# Altium project Wireless Jukebox.PrjPcb
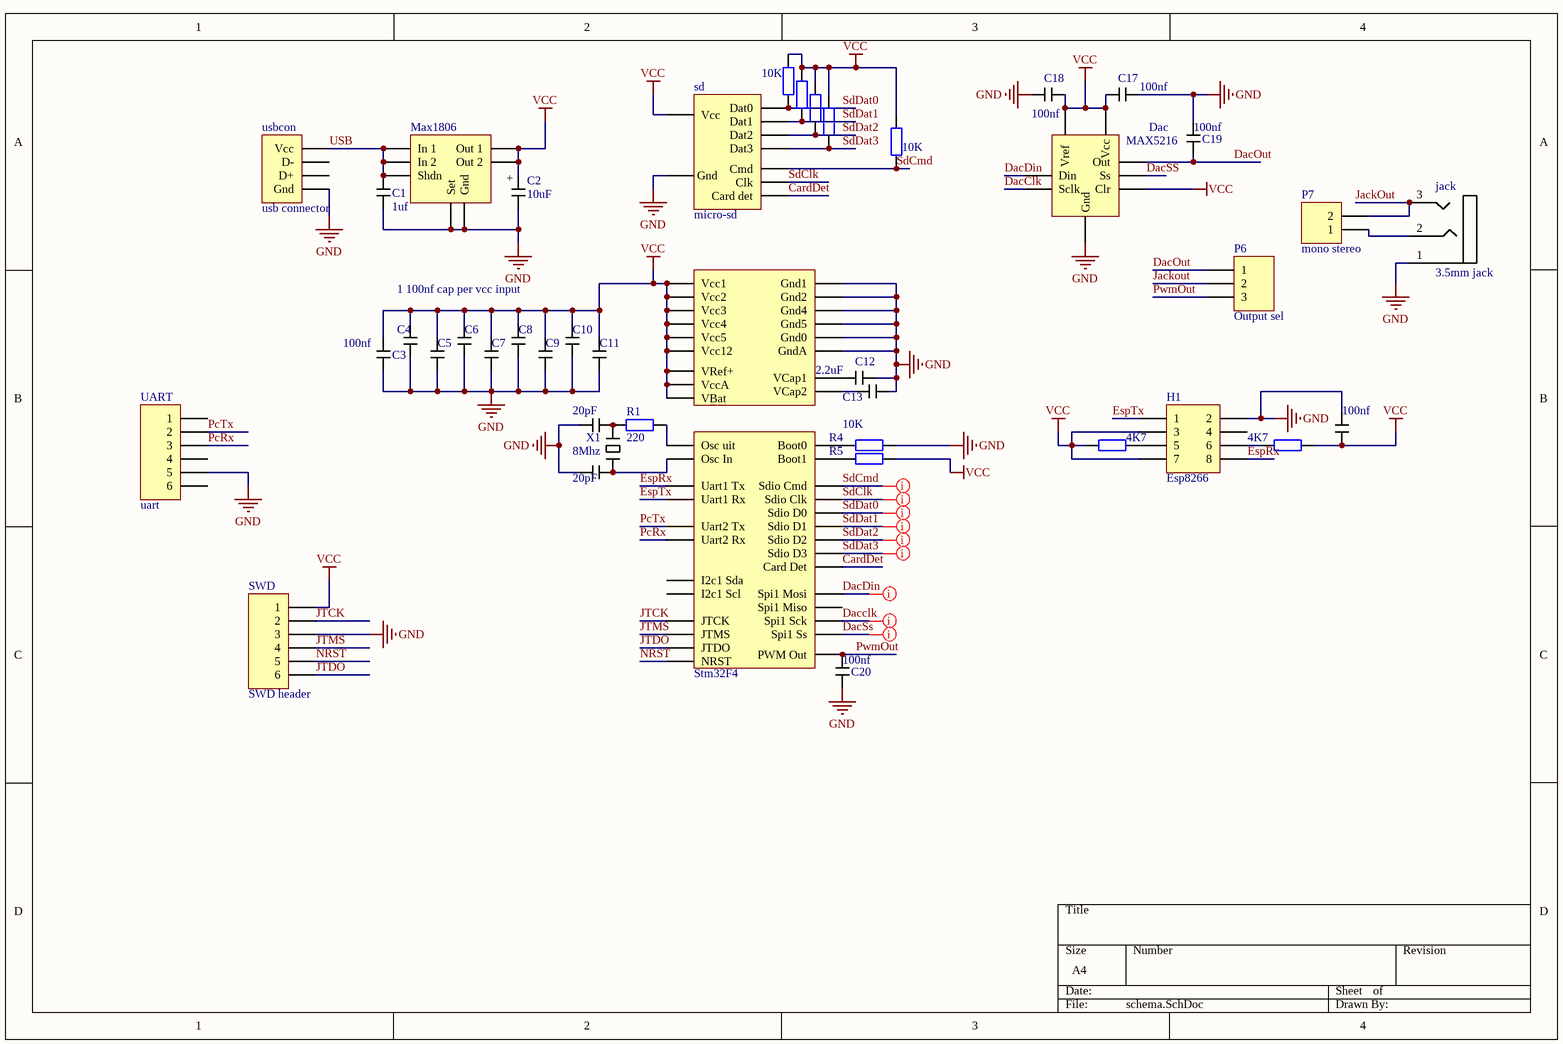
[diagram p0: schema.SchDoc]
1 sheet, 42 parts. Net scope: global (net labels, ports and power ports of the same name join across sheets).
Board file: PCB.PcbDoc

## Sheet schema.SchDoc
size A4

### Parts
C1  value 1uf  [RESC2012N]  (hidden comment: capacitor)
C2  value 10uF  [Capacitor]  (hidden comment: capacitor)
C3  value 100nf  [RESC2012N]  (hidden comment: capacitor)
C4  capacitor  [RESC2012N]  (value not drawn)
C5  capacitor  [RESC2012N]  (value not drawn)
C6  capacitor  [RESC2012N]  (value not drawn)
C7  capacitor  [RESC2012N]  (value not drawn)
C8  capacitor  [RESC2012N]  (value not drawn)
C9  capacitor  [RESC2012N]  (value not drawn)
C10  capacitor  [RESC2012N]  (value not drawn)
C11  capacitor  [RESC2012N]  (value not drawn)
C12  value 2.2uF  [RESC2012N]  (hidden comment: capacitor)
C13  capacitor  [RESC2012N]  (value not drawn)
C14  value 20pF  [RESC2012N]  (hidden comment: capacitor)
C15  value 20pF  [RESC2012N]  (hidden comment: capacitor)
C16  value 100nf  [RESC2012N]  (hidden comment: capacitor)
C17  value 100nf  [RESC2012N]  (hidden comment: capacitor)
C18  value 100nf  [RESC2012N]  (hidden comment: capacitor)
C19  value 100nf  [RESC2012N]  (hidden comment: capacitor)
C20  value 100nf  [RESC2012N]  (hidden comment: capacitor)
Dac  MAX5216  [uMax8]
H1  Esp8266  [HDR2X4]
jack  3.5mm jack  [3.5 jack]
Max1806  Max1806  [uMax8]  (value not drawn)
P6  Output sel  [HDR1X3]
P7  mono stereo  [HDR1X2]
R1  value 220  [RESC2012N]
R2  value 4K7  [RESC2012N]
R3  value 4K7  [RESC2012N]
R4  value 10K  [RESC2012N]
R5  (no value)  [RESC2012N]
R7  (no value)  [RESC2012N]
R8  value 10K  [RESC2012N]
R9  (no value)  [RESC2012N]
R10  value 10K  [RESC2012N]
R-Pullup  (no value)  [RESC2012N]
sd  micro-sd  [Micro-sd-socket]
Stm32F4  stm32f411vet6  [LQFP100]  (value not drawn)
SWD  SWD header  [HDR1X6]
UART  uart  [HDR1X6]
usbcon  usb connector  [usb B-con]
X1  8Mhz  [HC-49S]

### Nets
GND: C1.1(p0) C2.1(p0) C3.1(p0) C4.1(p0) C5.1(p0) C6.1(p0) C7.1(p0) C8.1(p0) C9.2(p1) C10.1(p0) C11.1(p0) C12.2(p1) C13.2(p1) C14.1(p0) C15.1(p0) C16.1(p0) C17.2(p1) C18.1(p0) C19.2(p1) C20.1(p0) Dac.8(Gnd) H1.2 jack.1 Max1806.5(Gnd) Max1806.6(Set) R4.2 sd.6(Gnd) Stm32F4.10(Gnd5) Stm32F4.20(GndA) Stm32F4.27(Gnd4) Stm32F4.49(Gnd1) Stm32F4.74(Gnd2) Stm32F4.99(Gnd0) SWD.3 UART.5 usbcon.Gnd
VCC: C2.2(p1) C3.2(p1) C4.2(p1) C5.2(p1) C6.2(p1) C7.2(p1) C8.2(p1) C9.1(p0) C10.2(p1) C11.2(p1) C16.2(p1) C17.1(p0) C18.2(p1) Dac.1(Vref) Dac.5(Clr) Dac.7(Vcc) H1.3 H1.7 Max1806.7(Out_1) Max1806.8(Out_2) R2.1 R3.2 R5.2 R7.2 R8.2 R9.2 R10.2 R-Pullup.2 sd.4(Vcc) Stm32F4.6(VBat) Stm32F4.11(Vcc5) Stm32F4.19(Vcc12) Stm32F4.21(VRef+) Stm32F4.22(VccA) Stm32F4.28(Vcc4) Stm32F4.50(Vcc1) Stm32F4.75(Vcc2) Stm32F4.100(Vcc3) SWD.1
CardDet: sd.9(Card_det) Stm32F4.64(Card_Det)
DacClk: Dac.3(Sclk) Stm32F4.30(Spi1_Sck)
DacDin: Dac.4(Din) Stm32F4.32(Spi1_Mosi)
DacOut: C19.1(p0) Dac.6(Out) P6.1
DacSS: Dac.2(Ss) Stm32F4.29(Spi1_Ss)
EspRx: H1.8 Stm32F4.77(Uart1_Tx)
EspTx: H1.1 Stm32F4.69(Uart1_Rx)
JackOut: jack.3 P6.2 P7.2
JTCK: Stm32F4.76(JTCK) SWD.2
JTDO: Stm32F4.89(JTDO) SWD.6
JTMS: Stm32F4.72(JTMS) SWD.4
NRST: Stm32F4.14(NRST) SWD.5
PcRx: Stm32F4.26(Uart2_Rx) UART.3
PcTx: Stm32F4.25(Uart2_Tx) UART.2
PwmOut: C20.2(p1) P6.3 Stm32F4.61(PWM_Out)
SdClk: sd.5(Clk) Stm32F4.54(Sdio_Clk)
SdCmd: R10.1 sd.3(Cmd) Stm32F4.31(Sdio_Cmd)
SdDat0: R-Pullup.1 sd.7(Dat0) Stm32F4.65(Sdio_D0)
SdDat1: R7.1 sd.8(Dat1) Stm32F4.66(Sdio_D1)
SdDat2: R8.1 sd.1(Dat2) Stm32F4.68(Sdio_D2)
SdDat3: R9.1 sd.2(Dat3) Stm32F4.79(Sdio_D3)
USB: C1.2(p1) Max1806.1(In_1) Max1806.2(In_2) Max1806.4(Shdn) usbcon.Vcc
NetC12_1: C12.1(p0) Stm32F4.48(VCap1)
NetC13_1: C13.1(p0) Stm32F4.73(VCap2)
NetC14_2: C14.2(p1) R1.1 X1.2(x2)
NetC15_2: C15.2(p1) Stm32F4.12(Osc_In) X1.1(x1)
NetH1_5: H1.5 R2.2
NetH1_6: H1.6 R3.1
Netjack_2: jack.2 P7.1
NetR1_2: R1.2 Stm32F4.13(Osc_uit)
NetR4_1: R4.1 Stm32F4.94(Boot0)
NetR5_1: R5.1 Stm32F4.37(Boot1)

Not connected (* = marked no-connect by the designer): H1 4; Stm32F4 90(Spi1_Miso) 92(I2c1_Scl) 93(I2c1_Sda); UART 1 4 6; usbcon D+ D-

### Layout directives
net class sdio: SdClk, SdCmd, SdDat0, SdDat1, SdDat2, SdDat3
net class dac: DacClk, DacDin, DacSS

### Notes on the sheet
- 1 100nf cap per vcc input
- (in symbol cap_Pol) +

### Library data of the parts
C1 C3 C12 C14-C20 = cap
C2 = cap_Pol
C4-C11 = cap: value: 100nf
C13 = cap: value: 2.2uF
H1 = Header 4X2: Header, 4-Pin, Dual row; LatestRevisionDate: 17-Jul-2002; LatestRevisionNote: Re-released for DXP Platform.; Publisher: Altium Limited
Max1806 = Max1806: output: 3.3v
P6 = Header 3: Header, 3-Pin; LatestRevisionDate: 17-Jul-2002; LatestRevisionNote: Re-released for DXP Platform.; Publisher: Altium Limited
P7 = Header 2: Header, 2-Pin; LatestRevisionDate: 17-Jul-2002; LatestRevisionNote: Re-released for DXP Platform.; Publisher: Altium Limited
R1-R4 R8 R10 = Res2: Resistor; Published: 8-Jun-2000; LatestRevisionDate: 17-Jul-2002; LatestRevisionNote: Re-released for DXP Platform.; PackageReference: AXIAL-0.4; Publisher: Altium Limited
R5 R7 R9 R-Pullup = Res2: Resistor; Value: 10K; Published: 8-Jun-2000; LatestRevisionDate: 17-Jul-2002; LatestRevisionNote: Re-released for DXP Platform.; PackageReference: AXIAL-0.4; Publisher: Altium Limited
SWD UART = Header 6: Header, 6-Pin; LatestRevisionDate: 17-Jul-2002; LatestRevisionNote: Re-released for DXP Platform.; Publisher: Altium Limited
X1 = Cilinder_kristal